# Altium schematic sheet PIC_POWER_MISC.SchDoc
size A3; ApprovedBy: D. Grossman; CheckedBy: G. Engel; Author: Y. Yakov; CompanyName: LightSense; DrawnBy: Y. Yakov; Engineer: Y.Yakov; Organization: LightSense
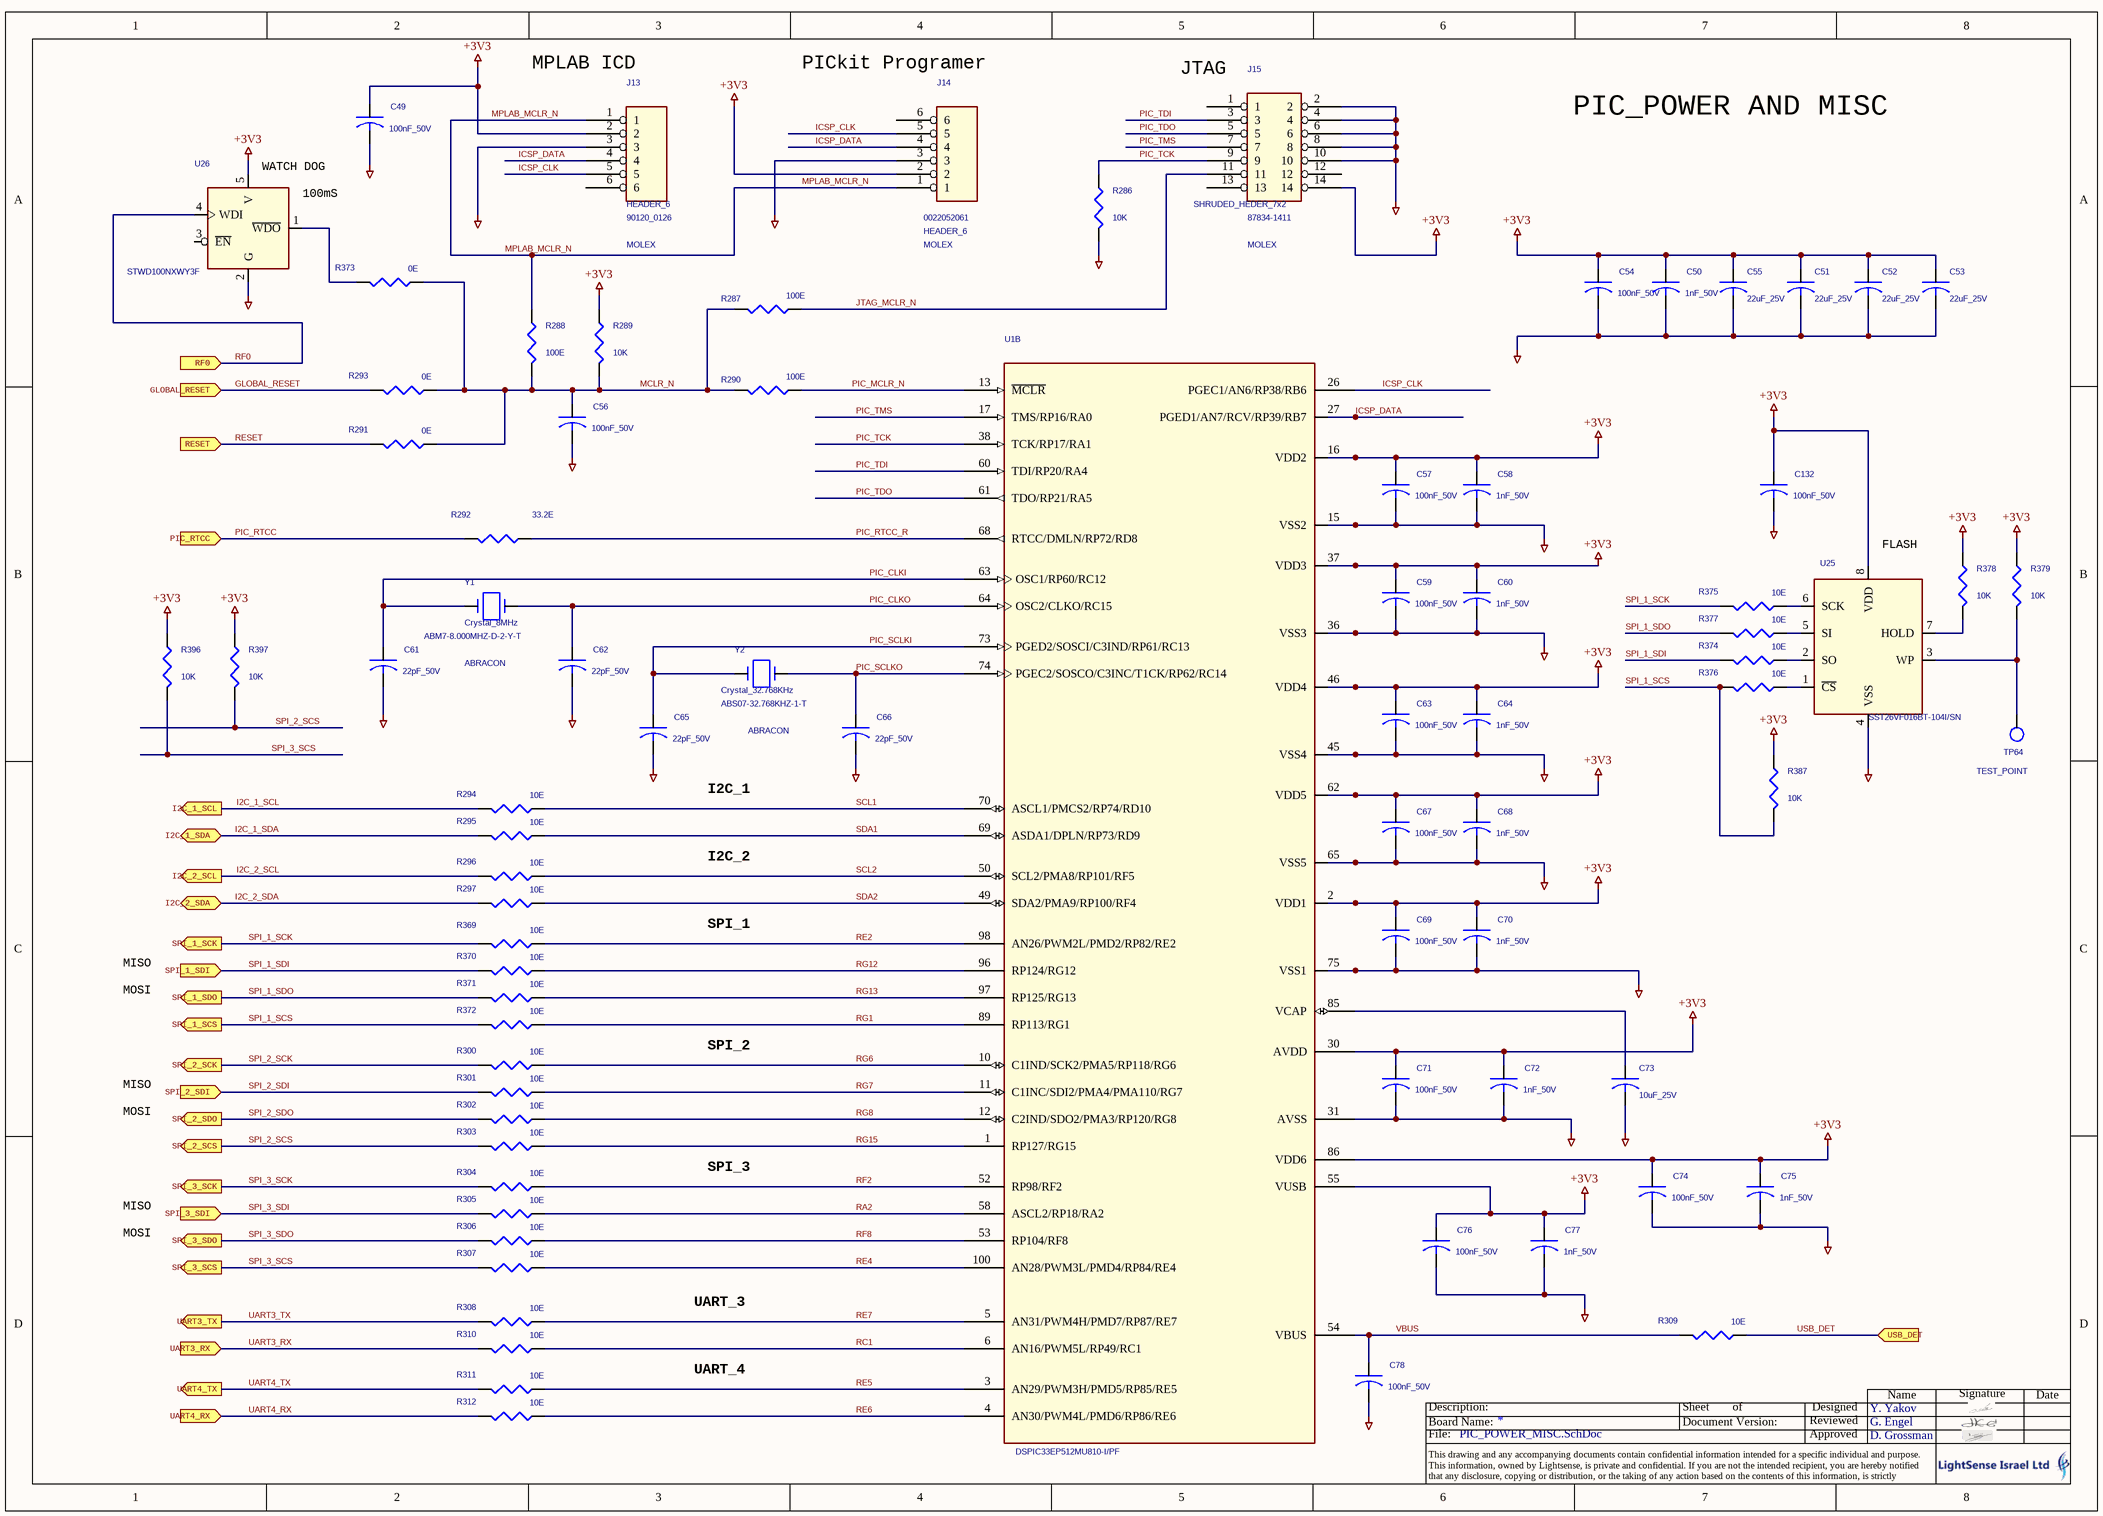
[diagram p0: PIC_POWER_MISC.SchDoc]

## Parts
C49  100nF_50V  [0603]
C50  1nF_50V  [0603]
C51  22uF_25V  [1210]
C52  22uF_25V  [1210]
C53  22uF_25V  [1210]
C54  100nF_50V  [0603]
C55  22uF_25V  [1210]
C56  100nF_50V  [0603]
C57  100nF_50V  [0603]
C58  1nF_50V  [0603]
C59  100nF_50V  [0603]
C60  1nF_50V  [0603]
C61  22pF_50V  [0603]
C62  22pF_50V  [0603]
C63  100nF_50V  [0603]
C64  1nF_50V  [0603]
C65  22pF_50V  [0603]
C66  22pF_50V  [0603]
C67  100nF_50V  [0603]
C68  1nF_50V  [0603]
C69  100nF_50V  [0603]
C70  1nF_50V  [0603]
C71  100nF_50V  [0603]
C72  1nF_50V  [0603]
C73  10uF_25V  [1206]
C74  100nF_50V  [0603]
C75  1nF_50V  [0603]
C76  100nF_50V  [0603]
C77  1nF_50V  [0603]
C78  100nF_50V  [0603]
C132  100nF_50V  [0603]
J13  HEADER_6  MFG: MOLEX  MFG_PN: 90120_0126  [HEADER_6PIN_100mil]
J14  HEADER_6  MFG_PN: 0022052061  MFG: MOLEX  [HEADER_6PIN_100mil]
J15  SHRUDED_HEDER_7x2  MFG: MOLEX  MFG_PN: 87834-1411  [SH_HEAD_2x7PIN_100mil]
R286  10K  [0603]
R287  100E  [0603]
R288  100E  [0603]
R289  10K  [0603]
R290  100E  [0603]
R291  0E  [0603]
R292  33.2E  [0603]
R293  0E  [0603]
R294  10E  [0603]
R295  10E  [0603]
R296  10E  [0603]
R297  10E  [0603]
R300  10E  [0603]
R301  10E  [0603]
R302  10E  [0603]
R303  10E  [0603]
R304  10E  [0603]
R305  10E  [0603]
R306  10E  [0603]
R307  10E  [0603]
R308  10E  [0603]
R309  10E  [0603]
R310  10E  [0603]
R311  10E  [0603]
R312  10E  [0603]
R369  10E  [0603]
R370  10E  [0603]
R371  10E  [0603]
R372  10E  [0603]
R373  0E  [0603]
R374  10E  [0603]
R375  10E  [0603]
R376  10E  [0603]
R377  10E  [0603]
R378  10K  [0603]
R379  10K  [0603]
R387  10K  [0603]
R396  10K  [0603]
R397  10K  [0603]
TP64  TEST_POINT  [TH_1mm]
U1  DSPIC33EP512MU810-I/PF  [TQFP_100]  (part B of 2)
U25  SST26VF016BT-104I/SN  [SOIC_8]
U26  STWD100NXWY3F  [SOT_23_5]
Y1  Crystal_8MHz  MFG_PN: ABM7-8.000MHZ-D-2-Y-T  MFG: ABRACON  [ABM7_SMD_2PIN]
Y2  Crystal_32.768KHz  MFG: ABRACON  MFG_PN: ABS07-32.768KHZ-1-T  [ABS07_SMD_2PIN]

## Ports
GLOBAL_RESET (in), I2C_1_SCL (out), I2C_1_SDA (bidir), I2C_2_SCL (out), I2C_2_SDA (bidir), PIC_RTCC (in), RESET (in), RF0 (in), SPI_1_SCK (out), SPI_1_SCS (out), SPI_1_SDI (in), SPI_1_SDO (out), SPI_2_SCK (out), SPI_2_SCS (out), SPI_2_SDI (in), SPI_2_SDO (out), SPI_3_SCK (out), SPI_3_SCS (out), SPI_3_SDI (in), SPI_3_SDO (out), UART3_RX (in), UART3_TX (out), UART4_RX (in), UART4_TX (out), USB_DET (in)

## Nets
+3V3: C49.1 C50.1 C51.1 C52.1 C53.1 C54.1 C55.1 C57.1 C58.1 C59.1 C60.1 C63.1 C64.1 C67.1 C68.1 C69.1 C70.1 C71.1 C72.1 C74.1 C75.1 C76.1 C77.1 C132.1 J13.2 J14.2 J15.14 R289.1 R378.1 R379.1 R387.1 R396.1 R397.1 U1.2(VDD1) U1.16(VDD2) U1.30(AVDD) U1.37(VDD3) U1.46(VDD4) U1.55(VUSB) U1.62(VDD5) U1.86(VDD6) U25.8(VDD) U26.5(V)
GND_CPU: C49.2 C50.2 C51.2 C52.2 C53.2 C54.2 C55.2 C56.2 C57.2 C58.2 C59.2 C60.2 C61.2 C62.2 C63.2 C64.2 C65.2 C66.2 C67.2 C68.2 C69.2 C70.2 C71.2 C72.2 C73.2 C74.2 C75.2 C76.2 C77.2 C78.2 C132.2 J13.3 J14.3 J15.2 J15.4 J15.6 J15.8 J15.10 R286.2 U1.15(VSS2) U1.31(AVSS) U1.36(VSS3) U1.45(VSS4) U1.65(VSS5) U1.75(VSS1) U25.4(VSS) U26.2(G)
GLOBAL_RESET: R293.2 ; port GLOBAL_RESET
I2C_1_SCL: R294.2 ; port I2C_1_SCL
I2C_1_SDA: R295.2 ; port I2C_1_SDA
I2C_2_SCL: R296.2 ; port I2C_2_SCL
I2C_2_SDA: R297.2 ; port I2C_2_SDA
ICSP_CLK: J13.5 J14.5 U1.26(PGEC1/AN6/RP38/RB6)
ICSP_DATA: J13.4 J14.4 U1.27(PGED1/AN7/RCV/RP39/RB7)
JTAG_MCLR_N: J15.11 R287.1
MCLR_N: C56.1 R287.2 R288.2 R289.2 R290.2 R291.1 R293.1 R373.1
MPLAB_MCLR_N: J13.1 J14.1 R288.1
PIC_CLKI: C61.1 U1.63(OSC1/RP60/RC12) Y1.1
PIC_CLKO: C62.1 U1.64(OSC2/CLKO/RC15) Y1.2
PIC_MCLR_N: R290.1 U1.13(~{MCLR})
PIC_RTCC: R292.2 ; port PIC_RTCC
PIC_RTCC_R: R292.1 U1.68(RTCC/DMLN/RP72/RD8)
PIC_SCLKI: C65.1 U1.73(PGED2/SOSCI/C3IND/RP61/RC13) Y2.1
PIC_SCLKO: C66.1 U1.74(PGEC2/SOSCO/C3INC/T1CK/RP62/RC14) Y2.2
PIC_TCK: J15.9 R286.1 U1.38(TCK/RP17/RA1)
PIC_TDI: J15.3 U1.60(TDI/RP20/RA4)
PIC_TDO: J15.5 U1.61(TDO/RP21/RA5)
PIC_TMS: J15.7 U1.17(TMS/RP16/RA0)
RA2: R305.1 U1.58(ASCL2/RP18/RA2)
RC1: R310.1 U1.6(AN16/PWM5L/RP49/RC1)
RE2: R369.1 U1.98(AN26/PWM2L/PMD2/RP82/RE2)
RE4: R307.1 U1.100(AN28/PWM3L/PMD4/RP84/RE4)
RE5: R311.1 U1.3(AN29/PWM3H/PMD5/RP85/RE5)
RE6: R312.1 U1.4(AN30/PWM4L/PMD6/RP86/RE6)
RE7: R308.1 U1.5(AN31/PWM4H/PMD7/RP87/RE7)
RESET: R291.2 ; port RESET
RF0: U26.4(WDI) ; port RF0
RF2: R304.1 U1.52(RP98/RF2)
RF8: R306.1 U1.53(RP104/RF8)
RG1: R372.1 U1.89(RP113/RG1)
RG6: R300.1 U1.10(C1IND/SCK2/PMA5/RP118/RG6)
RG7: R301.1 U1.11(C1INC/SDI2/PMA4/PMA110/RG7)
RG8: R302.1 U1.12(C2IND/SDO2/PMA3/RP120/RG8)
RG12: R370.1 U1.96(RP124/RG12)
RG13: R371.1 U1.97(RP125/RG13)
RG15: R303.1 U1.1(RP127/RG15)
SCL1: R294.1 U1.70(ASCL1/PMCS2/RP74/RD10)
SCL2: R296.1 U1.50(SCL2/PMA8/RP101/RF5)
SDA1: R295.1 U1.69(ASDA1/DPLN/RP73/RD9)
SDA2: R297.1 U1.49(SDA2/PMA9/RP100/RF4)
SPI_1_SCK: R369.2 R375.2 ; port SPI_1_SCK
SPI_1_SCS: R372.2 R376.2 R387.2 ; port SPI_1_SCS
SPI_1_SDI: R370.2 R374.2 ; port SPI_1_SDI
SPI_1_SDO: R371.2 R377.2 ; port SPI_1_SDO
SPI_2_SCK: R300.2 ; port SPI_2_SCK
SPI_2_SCS: R303.2 R397.2 ; port SPI_2_SCS
SPI_2_SDI: R301.2 ; port SPI_2_SDI
SPI_2_SDO: R302.2 ; port SPI_2_SDO
SPI_3_SCK: R304.2 ; port SPI_3_SCK
SPI_3_SCS: R307.2 R396.2 ; port SPI_3_SCS
SPI_3_SDI: R305.2 ; port SPI_3_SDI
SPI_3_SDO: R306.2 ; port SPI_3_SDO
UART3_RX: R310.2 ; port UART3_RX
UART3_TX: R308.2 ; port UART3_TX
UART4_RX: R312.2 ; port UART4_RX
UART4_TX: R311.2 ; port UART4_TX
USB_DET: R309.1 ; port USB_DET
VBUS: C78.1 R309.2 U1.54(VBUS)
NetC73_1: C73.1 U1.85(VCAP)
NetR373_2: R373.2 U26.1(~{WDO})
NetR374_1: R374.1 U25.2(SO)
NetR375_1: R375.1 U25.6(SCK)
NetR376_1: R376.1 U25.1(~{CS})
NetR377_1: R377.1 U25.5(SI)
NetR378_2: R378.2 U25.7(HOLD)
NetR379_2: R379.2 TP64.1(TP) U25.3(WP)

Not connected (* = marked no-connect by the designer): J13 6; J14 6; J15 1 12 13; U26 3(~{EN})

## Notes on the sheet
- (near J13) MPLAB ICD
- (near J14) PICkit Programer
- (near J15) JTAG
- PIC_POWER AND MISC
- (near U26) WATCH DOG
- (near U26) 100mS
- (near U25) FLASH
- I2C_1
- I2C_2
- SPI_1
- MISO
- MOSI
- SPI_2
- SPI_3
- UART_3
- UART_4
- Name
- Signature
- Date
- File:
- Board Name:
- Description:
- Document Version:
- Sheet
- of
- Approved
- Reviewed
- Designed
- This drawing and any accompanying documents contain confidential information intended for a specific individual and purpose.
  This information, owned by Lightsense, is private and confidential. If you are not the intended recipient, you are hereby notified that any disclosure, copying or distribution, or the taking of any action based on the contents of this information, is strictly prohibited.

## Library data of the parts
C49 C56 C57 C59 C63 C67 C69 C74 C78 C132 = C: CAP_SMT_0603_50V_X7R_10%; MFG: KEMET; MFG_PN: C0603C104K5RAC
C50 C72 C77 = C: CAP_SMT_0603_50V_X7R_10%; MFG_PN: C0603C102K5RAC; MFG: KEMET
C51 C52 C55 = C: CAP_SMT_1210_25V_X7R_10%; MFG_PN: C1210C226K3RAC; MFG: KEMET
C53 = C: CAP_SMT_1210_25V_X7R_10%; MFG: KEMET; MFG_PN: C1210C226K3RAC
C54 C71 C76 = C: CAP_SMT_0603_50V_X7R_10%; MFG_PN: C0603C104K5RAC; MFG: KEMET
C58 C60 C64 C68 C70 C75 = C: CAP_SMT_0603_50V_X7R_10%; MFG: KEMET; MFG_PN: C0603C102K5RAC
C61 C65 C66 = C: CAP_SMT_0603_50V_COG_10%; MFG: KEMET; MFG_PN: C0603C220K5GACTU
C62 = C: CAP_SMT_0603_50V_COG_10%; MFG_PN: C0603C220K5GACTU; MFG: KEMET
C73 = C: CAP_SMT_1206_25V_X7R_10%; MFG: KEMET; MFG_PN: C1206C106K3RAC
J13 J14 = HEADER 6
J15 = HEDER_7x2
R286 R378 R379 R387 R396 R397 = R_Dup1: MFG: YAGEO; MFG_PN: RC0603FR-0710K0L
R287 R288 R290 = R_Dup1: MFG: YAGEO; MFG_PN: RC0603FR-07100RL
R289 = R_Dup1: MFG_PN: RC0603FR-0710K0L; MFG: YAGEO
R291 R373 = R_Dup1: MFG_PN: RC0603FR-070R00L; MFG: YAGEO
R292 = R_Dup1: MFG: YAGEO; MFG_PN: RC0603FR-0733R2L
R293 = R_Dup1: MFG: YAGEO; MFG_PN: RC0603FR-070R00L
R294-R297 R300-R307 R309 R311 R312 R370-R372 R374 R376 R377 = R_Dup1: MFG: YAGEO; MFG_PN: RC0603FR-0710R0L
R308 R310 R369 R375 = R_Dup1: MFG_PN: RC0603FR-0710R0L; MFG: YAGEO
TP64 = T POINT R_Dup1
U1 = DSPIC33EP512MU810-I/PF_0: MFG: MICROCHIP; MFG_PN: DSPIC33EP512MU810-I/PF
U25 = SST26VF016BT-104I/SN: MFG: MICROCHIP; MFG_PN: SST26VF016BT-104I/SN
U26 = STWD100NXWY3F: WATCHDOG_100ms_SOT_23_5; MFG: ST; MFG_PN: STWD100NXWY3F
Y1 Y2 = Quartz